# Altium schematic sheet total.SchDoc
size A4
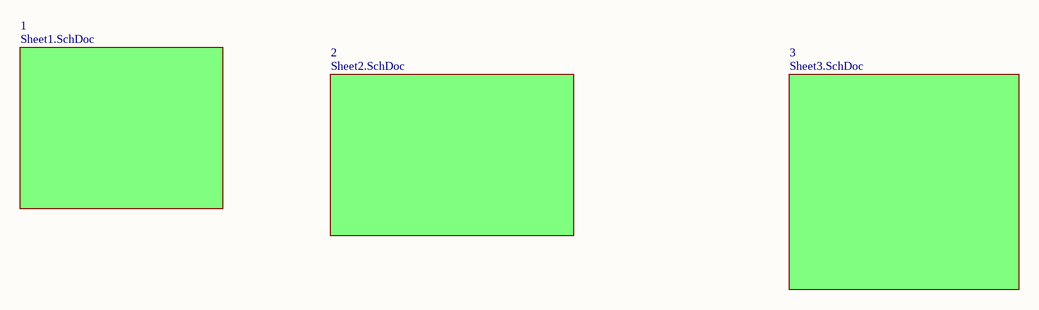
[diagram p0: total.SchDoc]

## Sub-sheets
1 = Sheet1.SchDoc: no entries
2 = Sheet2.SchDoc: no entries
3 = Sheet3.SchDoc: no entries